# EAGLE schematic sensor_tag (EAGLE 9.0.0)
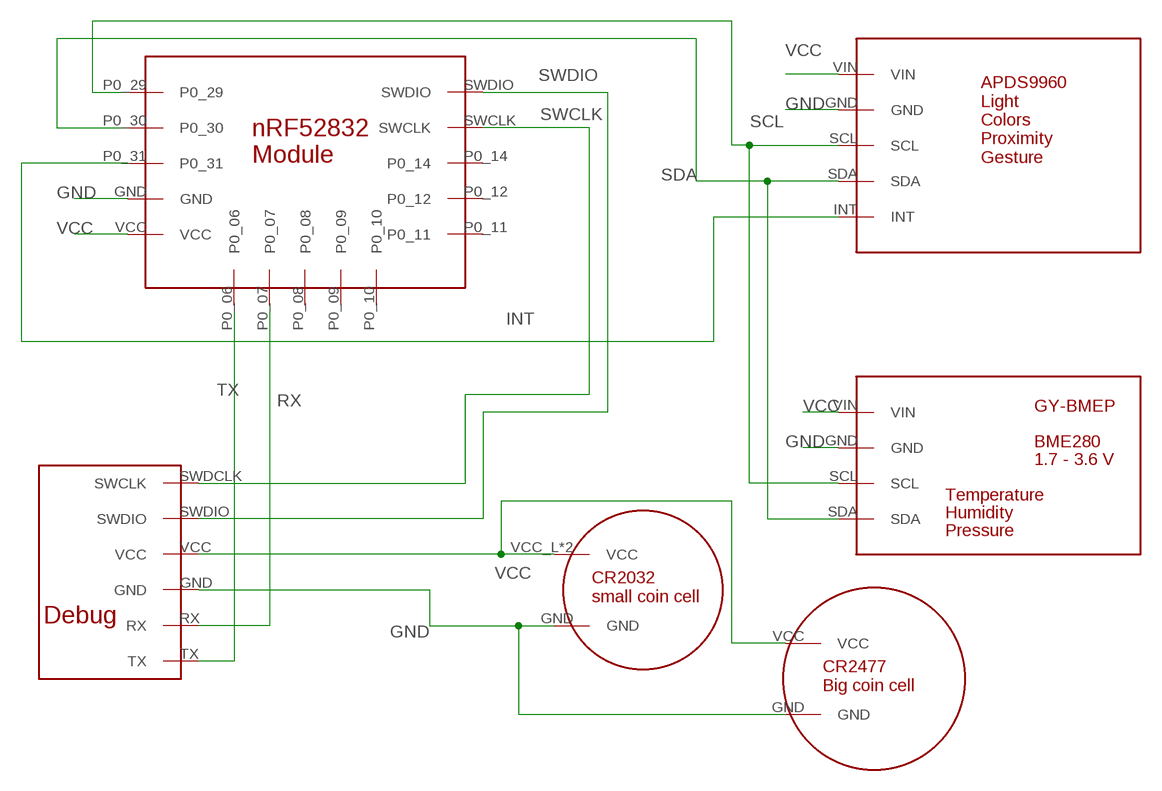
[diagram p0: schematic, sheet 1]

## Parts
U$1  GY-BMEPGY-BMEP-NOHOLE  [GY-BMEP-NOHOLE]
U$2  APDS9960_MODULEAPDS9960-FULL  [APDS9960-FULL]
U$3  NRF52832_MODULENRF52832_MOD_SMALL  [NRF52832_MOD_SMALL]
U$4  CR2032  [CR2032_SMD]
U$5  NRF_TAG_DEBUG  [NRF_TAG_DEBUG]
U$6  CR2477  [CR2477]

## Nets
GND: U$1.GND U$2.GND U$3.GND U$4.GND U$5.GND U$6.GND
INT: U$2.INT U$3.P0_31
RX: U$3.P0_07 U$5.RX
SCL: U$1.SCL U$2.SCL U$3.P0_29
SDA: U$1.SDA U$2.SDA U$3.P0_30
SWCLK: U$3.SWCLK U$5.SWDCLK(SWCLK)
SWDIO: U$3.SWDIO U$5.SWDIO
TX: U$3.P0_06 U$5.TX
VCC: U$1.VIN U$2.VIN U$3.VCC U$4.VCC_L(VCC) U$4.VCC_R(VCC) U$5.VCC U$6.VCC
Unconnected: U$3.P0_08 U$3.P0_09 U$3.P0_10 U$3.P0_11 U$3.P0_12 U$3.P0_14

## Library data of the parts
U$1 = GY-BMEP:GY-BMEP
U$2 = APDS9960:APDS9960_MODULE: This is the device for the APDS9960 module not the chip alone.
U$3 = nRF52832_module:NRF52832_MODULE
U$4 = cr2032:CR2032
U$5 = nrf_tag_debug:NRF_TAG_DEBUG
U$6 = cr2477:CR2477